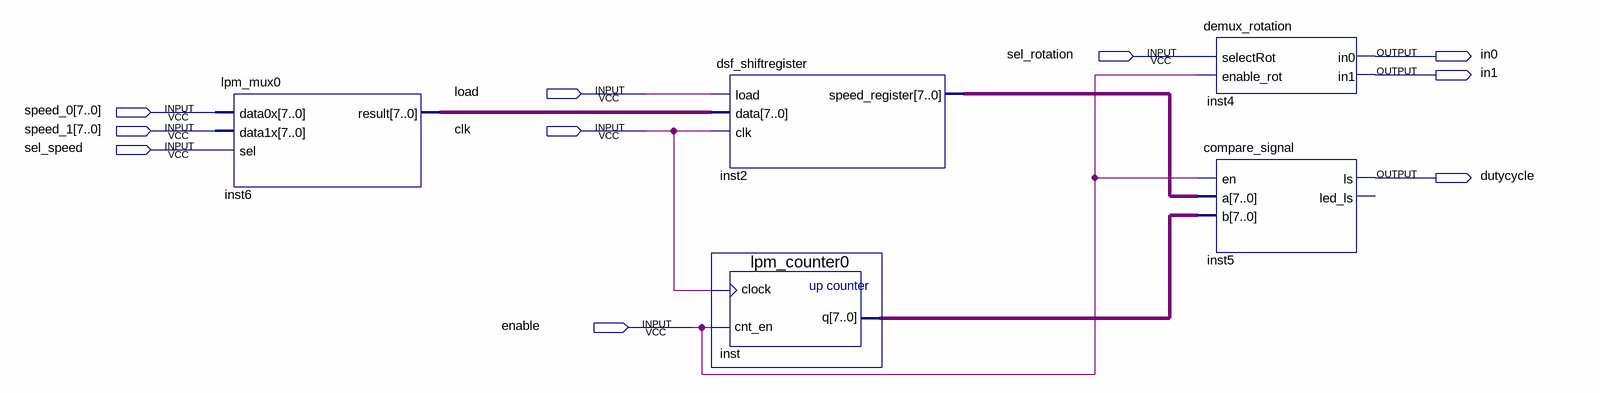
[diagram p0: schematic sheet]
// Quartus schematic pwm.bdf as structural Verilog: 5 symbols, 10 pins
module pwm (
  input  sel_rotation,
  input  load,
  input  [7:0] speed_0,
  input  [7:0] speed_1,
  input  clk,
  input  sel_speed,
  input  enable,
  output in0,
  output in1,
  output dutycycle
);

  wire [7:0] inst2_speed_register, inst6_result, inst_q;

  lpm_mux0 inst6 (.data0x(speed_0), .data1x(speed_1), .sel(sel_speed), .result(inst6_result));
  dsf_shiftregister inst2 (.load(load), .data(inst6_result), .clk(clk), .speed_register(inst2_speed_register));
  lpm_counter0 inst (.clock(clk), .cnt_en(enable), .q(inst_q));
  demux_rotation inst4 (.selectRot(sel_rotation), .enable_rot(enable), .in0(in0), .in1(in1));
  compare_signal inst5 (.en(enable), .a(inst2_speed_register), .b(inst_q), .ls(dutycycle));  // open: led_ls
endmodule
